# EAGLE design TQFP64 Programming Board (EAGLE 5.07)
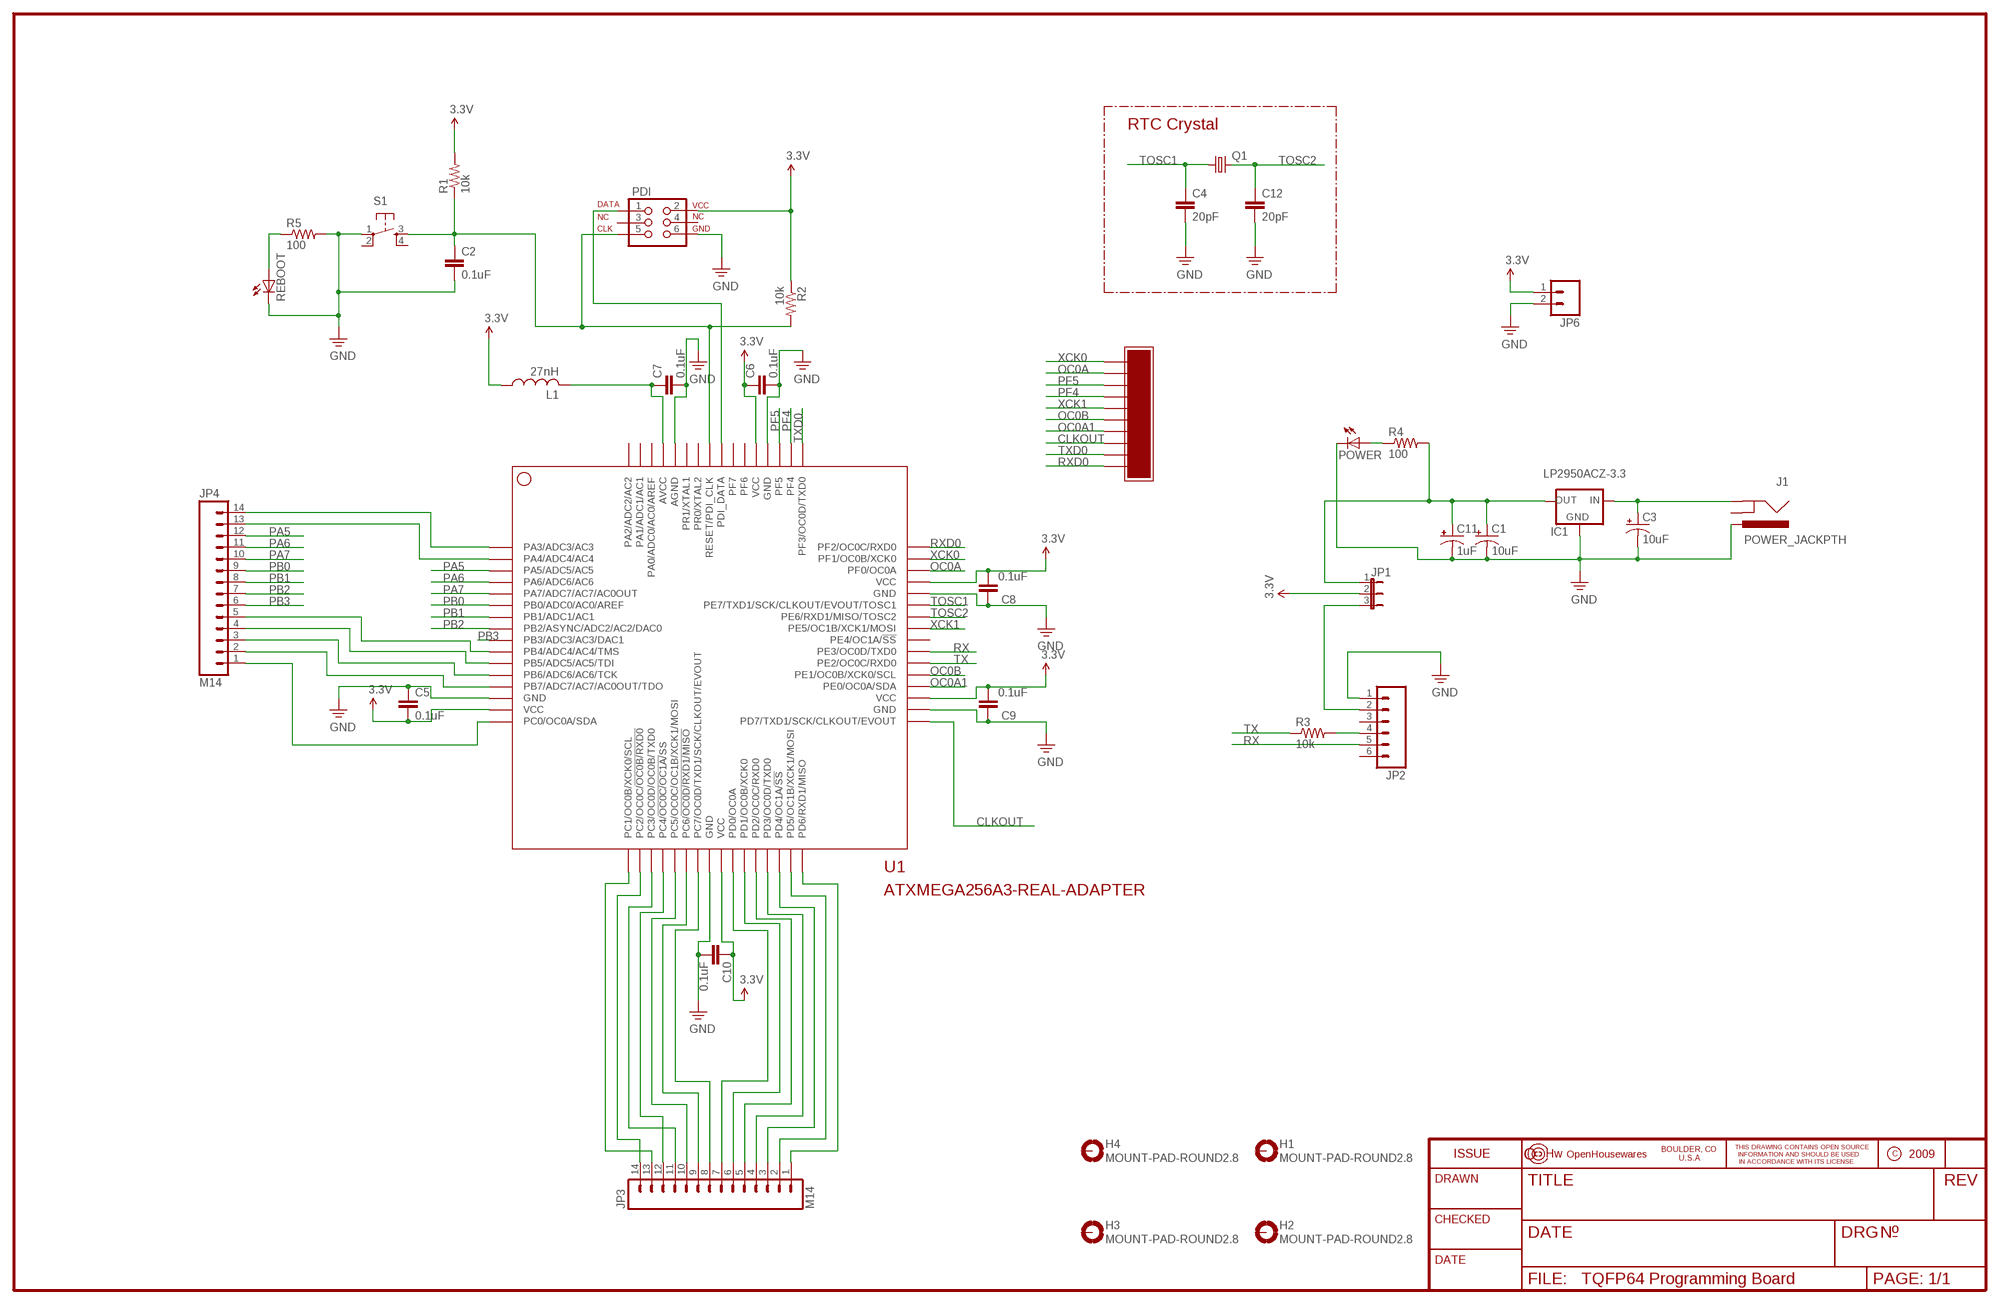
[diagram p0: schematic, sheet 1]

## Parts
C1  10uF  CPOL-USC/6032-28R  [C/6032-28R]
C2  0.1uF  C-EUC1206  [C1206]
C3  10uF  CPOL-USE2.5-5  [E2,5-5]
C4  20pF  C-EU025-024X044  [C025-024X044]
C5  0.1uF  C-EUC1206  [C1206]
C6  0.1uF  C-EUC1206  [C1206]
C7  0.1uF  C-EUC1206  [C1206]
C8  0.1uF  C-EUC1206  [C1206]
C9  0.1uF  C-EUC1206  [C1206]
C10  0.1uF  C-EUC1206  [C1206]
C11  1uF  CPOL-USE2.5-5  [E2,5-5]
C12  20pF  C-EU025-024X044  [C025-024X044]
H1  MOUNT-PAD-ROUND2.8  [2,8-PAD]
H2  MOUNT-PAD-ROUND2.8  [2,8-PAD]
H3  MOUNT-PAD-ROUND2.8  [2,8-PAD]
H4  MOUNT-PAD-ROUND2.8  [2,8-PAD]
IC1  LP2950ACZ-3.3  [TO92]
J1  POWER_JACKPTH  [POWER_JACK_PTH]
JP1  JP2W  [JP2W]
JP2  M06SIP  [1X06]
JP3  M14  [1X14]
JP4  M14  [1X14]
JP5  1X10_F_HEADER  [1X10_F_HEADER]
JP6  M02POLAR  [MOLEX-1X2]
L1  27nH  L-US0207/10  [0207/10]
PDI  XMEGA_PDI_PRGNS  [2X3-NS]
POWER  LED3MM  [LED3MM]
Q1  CRYSTALTC26H  [TC26H]
R1  10k  R-US_M1206  [M1206]
R2  10k  R-US_M1206  [M1206]
R3  10k  R-US_R1206  [R1206]
R4  100  R-US_0204/2V  [0204V]
R5  100  R-US_0204/2V  [0204V]
REBOOT  LED3MM  [LED3MM]
S1  TAC_SWITCHPTH  [TACTILE-PTH]
U1  ATXMEGA256A3-REAL-ADAPTER  [TQFP64-ADAPTER]

## Nets
3.3V: C5.2 C6.1 C8.2 C9.2 C10.1 JP1.2 JP6.1 L1.1 PDI.2 R1.2 R2.1 U1.15(VCC) U1.25(VCC) U1.35(VCC) U1.45(VCC) U1.53(VCC)
CLKOUT: JP5.8 U1.33(PD7/TXD1/SCK/CLKOUT/EVOUT)
GND: C1.- C2.2 C3.- C4.2 C5.1 C6.2 C7.2 C8.1 C9.1 C10.2 C11.- C12.2 IC1.2(GND) J1.PWR JP2.1 JP6.2 PDI.6 POWER.K(C) R5.2 REBOOT.K(C) S1.1 U1.14(GND) U1.24(GND) U1.34(GND) U1.44(GND) U1.52(GND) U1.60(AGND)
N$1: C2.1 PDI.5 R1.1 R2.2 S1.3 U1.57(RESET/PDI_CLK)
N$2: PDI.1 U1.56(PDI_DATA)
N$3: JP2.4 R3.2
N$4: JP1.3 JP2.2
N$5: C3.+ IC1.3(IN) J1.GND
N$6: JP3.10 U1.21(PC5/OC0C/OC1B/XCK1/MOSI)
N$7: C1.+ C11.+ IC1.1(OUT) JP1.1 R4.2
N$8: JP3.8 U1.23(PC7/OC0D/TXD1/SCK/CLKOUT/EVOUT)
N$9: JP3.9 U1.22(PC6/!OC0D/RXD1/MISO)
N$10: JP3.12 U1.20(PC4/!OC0C/OC1A/!SS)
N$11: JP3.11 U1.19(PC3/OC0D/OC0B/TXD0)
N$12: C7.1 L1.2 U1.61(AVCC)
N$13: JP3.14 U1.18(PC2/OC0C/!OC0B/RXD0)
N$14: JP3.13 U1.17(PC1/OC0B/XCK0/SCL)
N$15: JP3.7 U1.26(PD0/OC0A)
N$16: JP3.6 U1.27(PD1/OC0B/XCK0)
N$17: JP3.5 U1.28(PD2/OC0C/RXD0)
N$18: JP3.4 U1.29(PD3/OC0D/TXD0)
N$19: JP3.3 U1.30(PD4/OC1A/!SS)
N$20: JP3.2 U1.31(PD5/OC1B/XCK1/MOSI)
N$21: JP3.1 U1.32(PD6/RXD1/MISO)
N$22: JP4.14 U1.1(PA3/ADC3/AC3)
N$23: JP4.1 U1.16(PC0/OC0A/SDA)
N$24: JP4.2 U1.13(PB7/ADC7/AC7/AC0OUT/TDO)
N$25: JP4.13 U1.2(PA4/ADC4/AC4)
N$26: JP4.3 U1.12(PB6/ADC6/AC6/TCK)
N$27: JP4.4 U1.11(PB5/ADC5/AC5/TDI)
N$28: JP4.5 U1.10(PB4/ADC4/AC4/TMS)
N$31: POWER.A R4.1
N$32: R5.1 REBOOT.A
OC0A: JP5.2 U1.46(PF0/OC0A)
OC0A1: JP5.7 U1.36(PE0/OC0A/SDA)
OC0B: JP5.6 U1.37(PE1/OC0B/XCK0/SCL)
PA5: JP4.12 U1.3(PA5/ADC5/AC5)
PA6: JP4.11 U1.4(PA6/ADC6/AC6)
PA7: JP4.10 U1.5(PA7/ADC7/AC7/AC0OUT)
PB0: JP4.9 U1.6(PB0/ADC0/AC0/AREF)
PB1: JP4.8 U1.7(PB1/ADC1/AC1)
PB2: JP4.7 U1.8(PB2/ASYNC/ADC2/AC2/DAC0)
PB3: JP4.6 U1.9(PB3/ADC3/AC3/DAC1)
PF4: JP5.4 U1.50(PF4)
PF5: JP5.3 U1.51(PF5)
RX: JP2.5 U1.39(PE3/OC0D/TXD0)
RXD0: JP5.10 U1.48(PF2/OC0C/RXD0)
TOSC1: C4.1 Q1.1 U1.43(PE7/TXD1/SCK/CLKOUT/EVOUT/TOSC1)
TOSC2: C12.1 Q1.2 U1.42(PE6/RXD1/MISO/TOSC2)
TX: R3.1 U1.38(PE2/OC0C/RXD0)
TXD0: JP5.9 U1.49(PF3/OC0D/TXD0)
XCK0: JP5.1 U1.47(PF1/OC0B/XCK0)
XCK1: JP5.5 U1.41(PE5/OC1B/XCK1/MOSI)
Unconnected: H1.B2,8(MOUNT) H2.B2,8(MOUNT) H3.B2,8(MOUNT) H4.B2,8(MOUNT) J1.GNDBREAK JP2.3 JP2.6 PDI.3 PDI.4 S1.2 S1.4 U1.40(PE4/OC1A/!SS) U1.54(PF6) U1.55(PF7) U1.58(PR0/XTAL2) U1.59(PR1/XTAL1) U1.62(PA0/ADC0/AC0/AREF) U1.63(PA1/ADC1/AC1) U1.64(PA2/ADC2/AC2)

## Notes on the sheet
- RTC Crystal

## Library data of the parts
C1 C3 C11 = rcl:CPOL-US: POLARIZED CAPACITOR, American symbol
C2 C4-C10 C12 = rcl:C-EU: CAPACITOR, European symbol
H1-H4 = holes:MOUNT-PAD-ROUND: MOUNTING PAD, round
IC1 = v-reg:LP2950?*: Source: http://cache.national.com/ds/LP/LP2950.pdf
J1 = SparkFun:POWER_JACK: Power Jack This is the standard 5.5mm barrel jack for power. The PTH is the most common, proven, reliable, footprint. All others are experimental. The Slot footprint only works if the mill layer is transmitted to the PCB fab house so be warned. Spark Fun Electronics SKU : PRT-00119. Mating wall wart : TOL-00298 (and others)
JP1 = jumper:JP2W: JUMPER
JP2 = SparkFun:M06: Header 6 Standard 6-pin 0.1" header. Use with straight break away headers (SKU : PRT-00116), right angle break away headers (PRT-00553), swiss pins (PRT-00743), machine pins (PRT-00117), and female headers (PRT-00115). Molex polarized connector foot print use with SKU : PRT-08094 with associated crimp pins and housings. NOTES ON THE VARIANTS LOCK and LOCK_LONGPADS... This footprint was designed to help hold the alignment of a through-hole component (i.e. 6-pin header) while soldering it into place. You may notice that each hole has been shifted either up or down by 0.005 of an inch from it's more standard position (which is a perfectly straight line). This slight alteration caused the pins (the squares in the middle) to touch the edges of the holes. Because they are alternating, it causes a "brace" to hold the component in place. 0.005 has proven to be the perfect amount of "off-center" position when using our standard breakaway headers. Although looks a little odd when you look at the bare footprint, once you have a header in there, the alteration is very hard to notice. Also, if you push a header all the way into place, it is covered up entirely on the bottom side. This idea of altering the position of holes to aid alignment will be further integrated into the Sparkfun Library for other footprints. It can help hold any component with 3 or more connection pins.
JP3 JP4 = SparkFun:M14: Header 14 Standard 14-pin 0.1" header. Use with straight break away headers (SKU : PRT-00116), right angle break away headers (PRT-00553), swiss pins (PRT-00743), machine pins (PRT-00117), and female headers (PRT-00115).
JP5 = BattleDroids:1X10_F_HEADER
JP6 = SparkFun:M02: Header 2 Standard 2-pin 0.1" header. Use with straight break away headers (SKU : PRT-00116), right angle break away headers (PRT-00553), swiss pins (PRT-00743), machine pins (PRT-00117), and female headers (PRT-00115). Molex polarized connector foot print use with SKU : PRT-08233 with associated crimp pins and housings.
L1 = rcl:L-US: INDUCTOR, American symbol
PDI = BattleDroids:XMEGA_PDI_PRG: AVR ISP 6 Pin This is the reduced ISP connector for AVR programming. Common on Arduino. This footprint will take up less PCB space and can be used with a 10-pin to 6-pin adapter such as SKU: BOB-08508
POWER REBOOT = led:LED: LED OSRAM: - CHIPLED LG R971, LG N971, LY N971, LG Q971, LY Q971, LO R971, LY R971 LH N974, LH R974 LS Q976, LO Q976, LY Q976 LO Q996 - Hyper CHIPLED LW Q18S LB Q993, LB Q99A, LB R99A - SideLED LS A670, LO A670, LY A670, LG A670, LP A670 LB A673, LV A673, LT A673, LW A673 LH A674 LY A675 LS A676, LA A676, LO A676, LY A676, LW A676 LS A679, LY A679, LG A679 - Hyper Micro SIDELED® LS Y876, LA Y876, LO Y876, LY Y876 LT Y87S - SmartLED LW L88C, LW L88S LB L89C, LB L89S, LG L890 LS L89K, LO L89K, LY L89K LS L896, LA L896, LO L896, LY L896 - TOPLED LS T670, LO T670, LY T670, LG T670, LP T670 LSG T670, LSP T670, LSY T670, LOP T670, LYG T670 LG T671, LOG T671, LSG T671 LB T673, LV T673, LT T673, LW T673 LH T674 LS T676, LA T676, LO T676, LY T676, LB T676, LH T676, LSB T676, LW T676 LB T67C, LV T67C, LT T67C, LS T67K, LO T67K, LY T67K, LW E67C LS E67B, LA E67B, LO E67B, LY E67B, LB E67C, LV E67C, LT E67C LW T67C LS T679, LY T679, LG T679 LS T770, LO T770, LY T770, LG T770, LP T770 LB T773, LV T773, LT T773, LW T773 LH T774 LS E675, LA E675, LY E675, LS T675 LS T776, LA T776, LO T776, LY T776, LB T776 LHGB T686 LT T68C, LB T68C - Hyper Mini TOPLED® LB M676 - Mini TOPLED Santana® LG M470 LS M47K, LO M47K, LY M47K Source: http://www.osram.convergy.de LUXEON: - LUMILED® LXK2-PW12-R00, LXK2-PW12-S00, LXK2-PW14-U00, LXK2-PW14-V00 LXK2-PM12-R00, LXK2-PM12-S00, LXK2-PM14-U00 LXK2-PE12-Q00, LXK2-PE12-R00, LXK2-PE12-S00, LXK2-PE14-T00, LXK2-PE14-U00 LXK2-PB12-K00, LXK2-PB12-L00, LXK2-PB12-M00, LXK2-PB14-N00, LXK2-PB14-P00, LXK2-PB14-Q00 LXK2-PR12-L00, LXK2-PR12-M00, LXK2-PR14-Q00, LXK2-PR14-R00 LXK2-PD12-Q00, LXK2-PD12-R00, LXK2-PD12-S00 LXK2-PH12-R00, LXK2-PH12-S00 LXK2-PL12-P00, LXK2-PL12-Q00, LXK2-PL12-R00 Source: www.luxeon.com KINGBRIGHT: KA-3528ASYC Source: www.kingbright.com
Q1 = SparkFun:CRYSTAL: Crystals Various standard crystals. Proven footprints. Spark Fun Electronics SKU : COM-00534
R1-R5 = resistor:R-US_: RESISTOR, American symbol
S1 = SparkFun:TAC_SWITCH: Momentary Switch Button commonly used for reset or general input. Spark Fun Electronics SKU : COM-00097
U1 = BattleDroids:ATXMEGA256A3-REAL

## Board
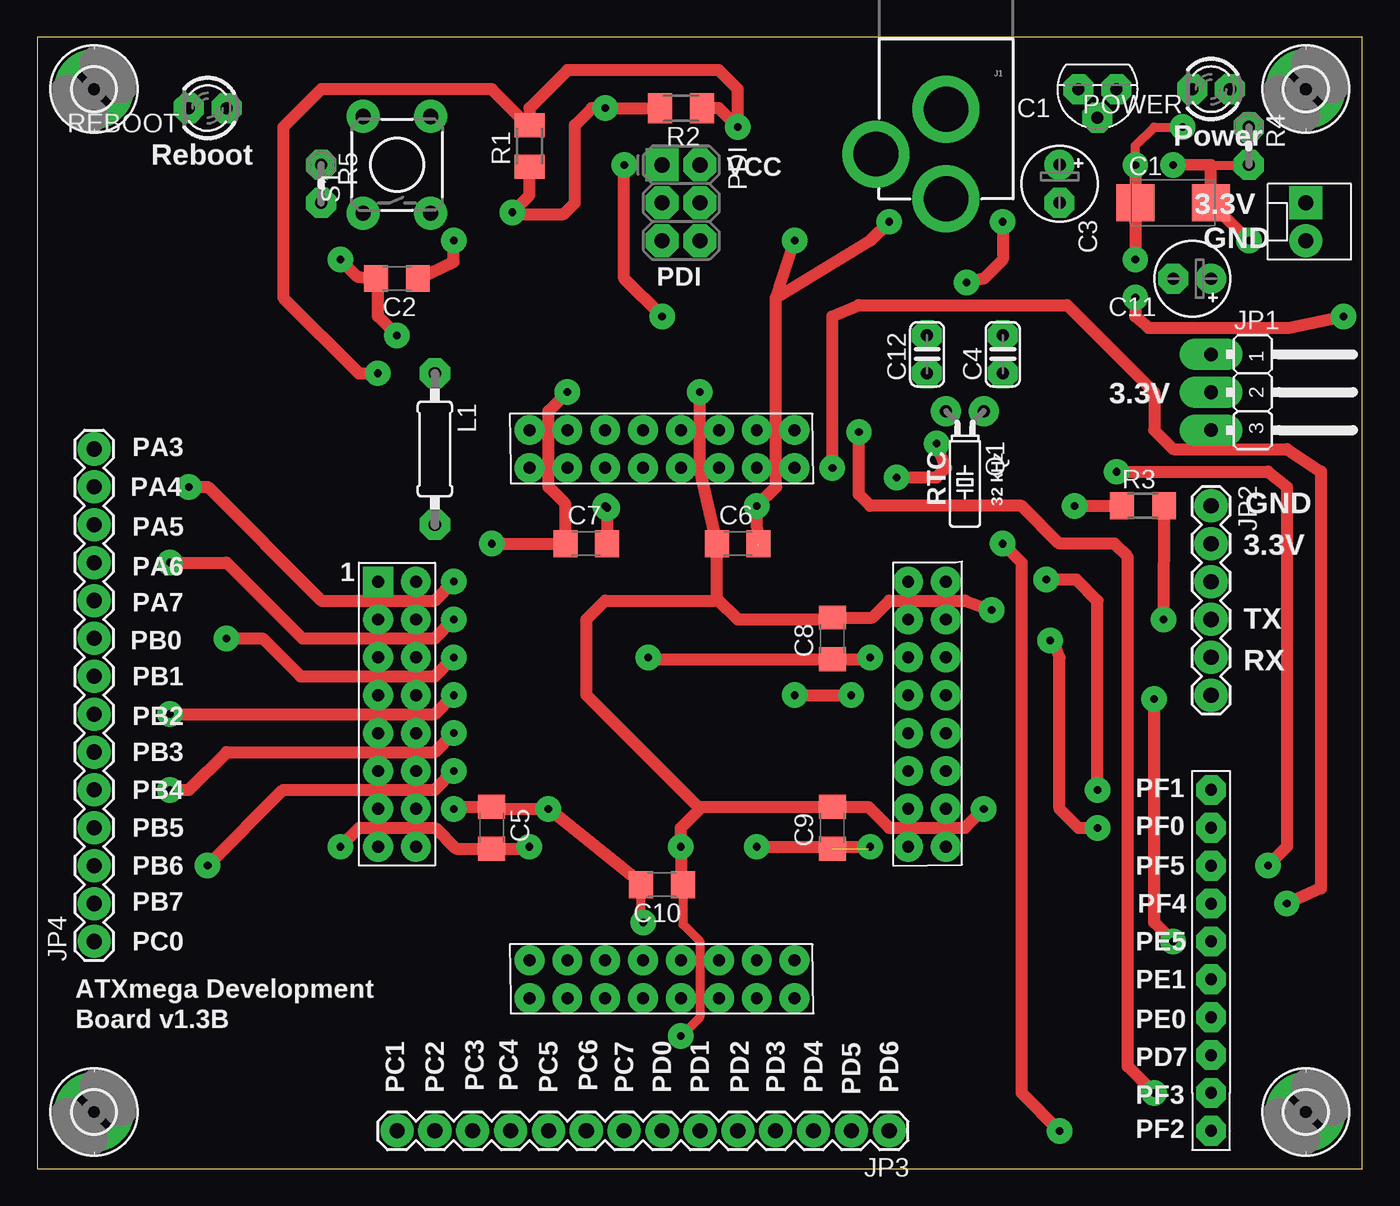
[diagram p1: board, top side]
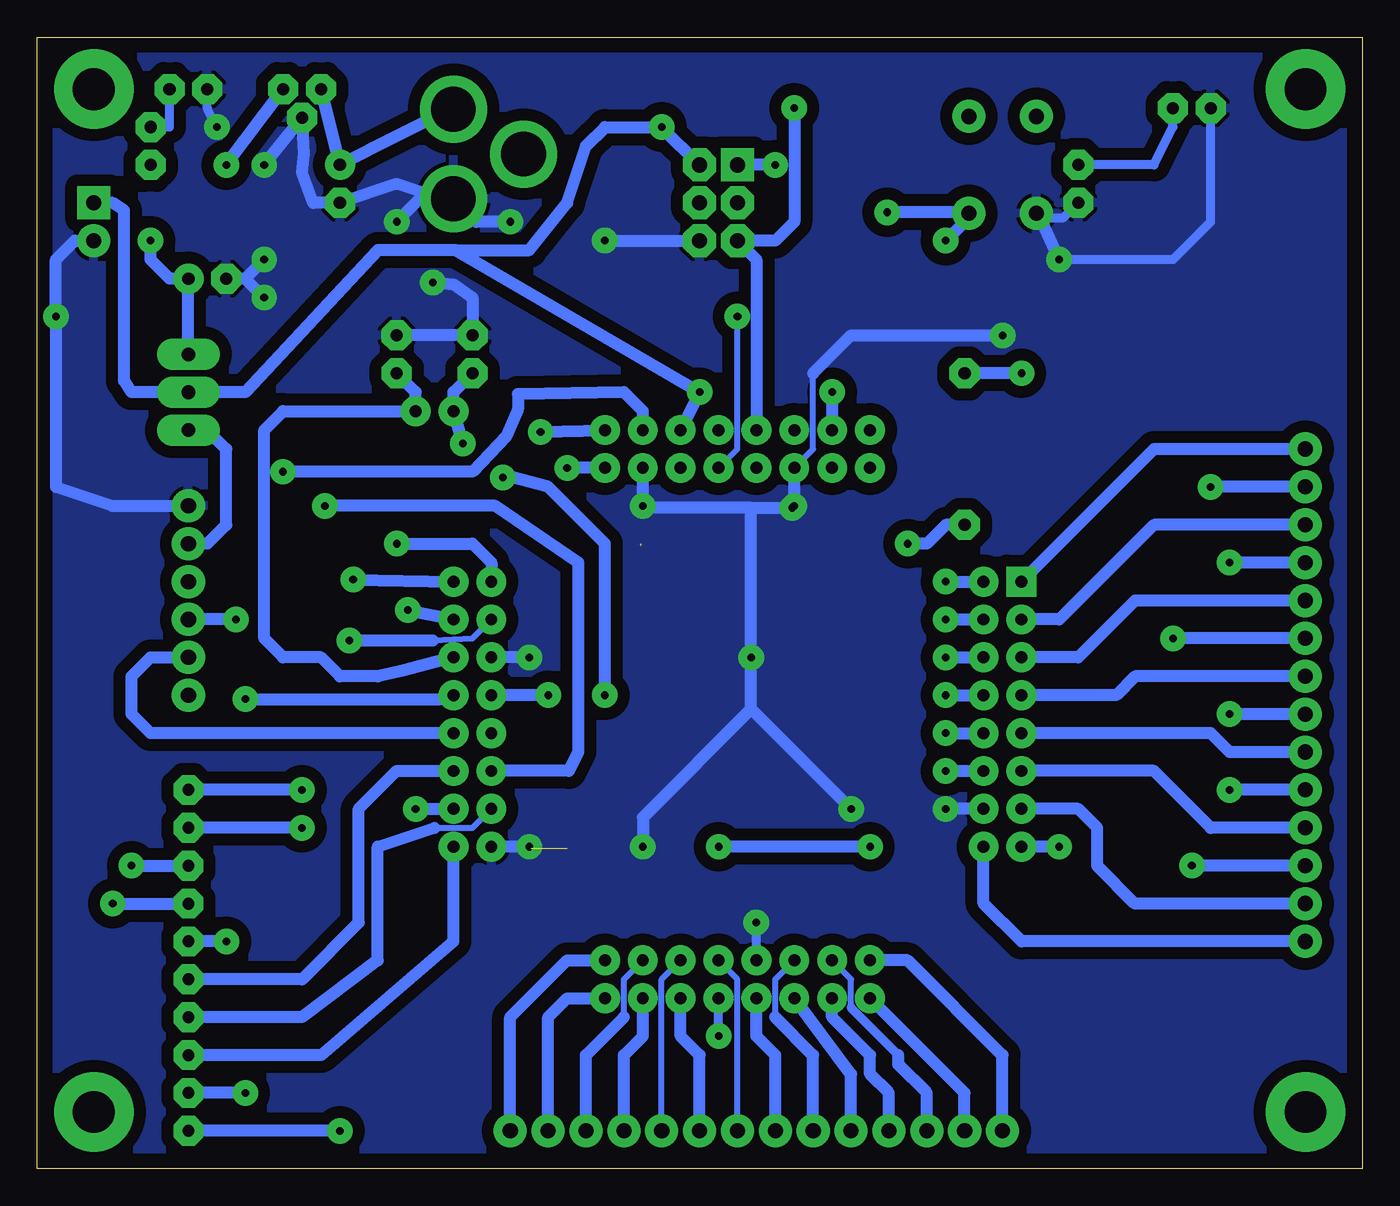
[diagram p2: board, bottom side, seen from below]

Size 88.88 x 75.87 mm. Coordinates in mm from the lower left corner, seen from the top.
Outline: 0,0 88.88,0 88.88,75.87 0,75.87 0,0
Copper layers (1*16): Top 0.035mm / dielectric 1.5mm / Bottom 0.035mm
Design rules "handmade": minimum track width 0.8mm, minimum drill 0.8mm, track to track 0.8mm, track to pad 0.8mm, pad to pad 0.45mm, via to via 0.8mm, smd to smd 8mil, copper to edge 40mil, drill to drill 8mil, minimum pad ring 0.6mm, minimum via ring 0.6mm, stop-mask expansion 4mil, vias tented up to drill 0mil, thermal gap 10mil

### Footprints (pad centres in the part's own frame; a part is rotated, then mirrored left to right if it is on the bottom)
C/6032-28R = smd 2.55 x 2.5: + 2.525,0; - -2.525,0
C1206 = smd 1.6 x 1.8: 1 -1.4,0; 2 1.4,0
E2,5-5 = drill 0.813 pad 1.6 round: + -1.27,0 | drill 0.813 pad 1.6 octagon: - 1.27,0
C025-024X044 = drill 0.813 octagon: 1 -1.27,0; 2 1.27,0
2,8-PAD = drill 2.8 pad 5.334 round: B2,8 0,0
TO92 = drill 0.813 octagon: 1 -1.27,0; 2 0,1.905; 3 1.27,0
POWER_JACK_PTH = drill 2.997 round: GND 0,7.7; GNDBREAK 4.7,10.7; PWR 0,13.7
JP2W = drill 0.914 long: 1 -2.54,-1.27; 2 0,-1.27; 3 2.54,-1.27
1X06 = drill 1.016 pad 1.88 round: 1 0,0; 2 2.54,0; 3 5.08,0; 4 7.62,0; 5 10.16,0; 6 12.7,0
1X14 = drill 1.016 pad 1.88 round: 1 0,0; 2 2.54,0; 3 5.08,0; 4 7.62,0; 5 10.16,0; 6 12.7,0; 7 15.24,0; 8 17.78,0; 9 20.32,0; 10 22.86,0; 11 25.4,0; 12 27.94,0; 13 30.48,0; 14 33.02,0
1X10_F_HEADER = drill 0.8 octagon: 1 0,12.7; 2 0,10.16; 3 0,7.62; 4 0,5.08; 5 0,2.54; 6 0,0; 7 0,-2.54; 8 0,-5.08; 9 0,-7.62; 10 0,-10.16
MOLEX-1X2 = drill 1.016 pad 1.88 square: 1 0,0 | drill 1.016 pad 1.88 round: 2 2.54,0
0207/10 = drill 0.813 octagon: 1 -5.08,0; 2 5.08,0
2X3-NS = drill 1.016 pad 1.88 square: 1 -2.54,-1.27 | drill 1.016 pad 1.88 octagon: 2 -2.54,1.27; 3 0,-1.27; 4 0,1.27; 5 2.54,-1.27; 6 2.54,1.27
LED3MM = drill 0.813 octagon: A -1.27,0; K 1.27,0
TC26H = drill 0.813 pad 1.676 round: 1 -1.27,0; 2 1.27,0
M1206 = smd 1.6 x 2: 1 -1.4,0; 2 1.4,0
R1206 = smd 1.6 x 1.803: 1 -1.422,0; 2 1.422,0
0204V = drill 0.813 octagon: 1 -1.27,0; 2 1.27,0
TACTILE-PTH = drill 1.016 round: 1 -3.251,2.261; 2 3.251,2.261; 3 -3.251,-2.261; 4 3.251,-2.261
TQFP64-ADAPTER = drill 0.8 square: 1 -17.78,10.16 | drill 0.8 round: 2 -15.24,10.16; 3 -17.78,7.62; 4 -15.24,7.62; 5 -17.78,5.08; 6 -15.24,5.08; 7 -17.78,2.54; 8 -15.24,2.54; 9 -17.78,0; 10 -15.24,0; 11 -17.78,-2.54; 12 -15.24,-2.54; 13 -17.78,-5.08; 14 -15.24,-5.08; 15 -17.78,-7.62; 16 -15.24,-7.62; 17 -7.62,-17.78; 18 -7.62,-15.24; 19 -5.08,-17.78; 20 -5.08,-15.24; 21 -2.54,-17.78; 22 -2.54,-15.24; 23 0,-17.78; 24 0,-15.24; 25 2.54,-17.78; 26 2.54,-15.24; 27 5.08,-17.78; 28 5.08,-15.24; 29 7.62,-17.78; 30 7.62,-15.24; 31 10.16,-17.78; 32 10.16,-15.24; 33 20.32,-7.62; 34 17.78,-7.62; 35 20.32,-5.08; 36 17.78,-5.08; 37 20.32,-2.54; 38 17.78,-2.54; 39 20.32,0; 40 17.78,0; 41 20.32,2.54; 42 17.78,2.54; 43 20.32,5.08; 44 17.78,5.08; 45 20.32,7.62; 46 17.78,7.62; 47 20.32,10.16; 48 17.78,10.16; 49 10.16,20.32; 50 10.16,17.78; 51 7.62,20.32; 52 7.62,17.78; 53 5.08,20.32; 54 5.08,17.78; 55 2.54,20.32; 56 2.54,17.78; 57 0,20.32; 58 0,17.78; 59 -2.54,20.32; 60 -2.54,17.78; 61 -5.08,20.32; 62 -5.08,17.78; 63 -7.62,20.32; 64 -7.62,17.78

### Placement (x,y rotation side)
C1  76.2,64.77 0 top
C2  24.13,59.69 180 top
C3  68.58,66.04 270 top
C4  64.77,54.61 90 top
C5  30.48,22.86 270 top
C6  46.99,41.91 0 top
C7  36.83,41.91 0 top
C8  53.34,35.56 90 top
C9  53.34,22.86 90 top
C10  41.91,19.05 180 top
C11  77.47,59.69 180 top
C12  59.69,54.61 90 top
H1  3.81,72.39 0 top
H2  3.81,3.81 0 top
H3  85.09,72.39 0 top
H4  85.09,3.81 0 top
IC1  71.12,72.39 180 top
J1  60.96,78.74 180 top
JP1  80.01,52.07 270 top
JP2  78.74,44.45 270 top
JP3  57.15,2.54 180 top
JP4  3.81,15.24 90 top
JP5  78.74,12.7 0 top
JP6  85.09,64.77 270 top
L1  26.67,48.26 270 top
PDI  43.18,64.77 270 top
POWER  78.74,72.39 180 top
Q1  62.23,50.8 180 top
R1  33.02,68.58 90 top
R2  43.18,71.12 180 top
R3  74.17,44.45 0 top
R4  81.28,68.58 270 top
R5  19.05,66.04 270 top
REBOOT  11.43,71.12 180 top
S1  24.13,67.31 90 top
U1  40.64,29.21 0 top

### Tracks (layer width: path | path; a pad name or v marks a point on that pad's centre or on a via)
3.3V  (via drill 0.51)
  Top 0.61: C10.1 43.31,16.38 44.45,15.24 44.45,10.16 v43.18,8.89
  Top 0.813: v44.45,52.07 44.45,46.86 C6.1 45.59,38.23 | R2.1 45.72,71.12 v46.99,69.85 46.99,72.39 45.72,73.66 35.56,73.66 33.02,71.12 R1.2 32.89,69.98 30.48,72.39 19.05,72.39 16.51,69.85 16.51,58.42 21.59,53.34 v22.86,53.34 | v20.32,21.59 21.59,22.86 26.67,22.86 28.07,21.46 C5.2 32.89,21.46 v33.02,21.59 | v63.5,24.13 62.23,22.86 57.15,22.86 55.75,24.26 C9.2 44.58,24.26 44.45,24.13 | v64.01,37.47 62.23,38.1 57.15,38.1 56.01,36.96 C8.2 53.21,36.83 46.99,36.83 45.59,38.23 | C10.1 43.18,19.18 v43.18,21.59 43.18,22.86 44.45,24.13 | 44.45,24.13 36.83,31.75 36.83,36.83 38.1,38.1 45.46,38.1 45.59,38.23
  Bottom 0.61: v43.18,8.89 U1.25
  Bottom 0.813: 60.83,61.59 55.88,61.59 53.34,64.77 52.07,68.58 50.8,69.85 v46.99,69.85 PDI.2 | 60.83,61.59 66.04,61.59 74.93,52.07 JP1.2 82.55,52.07 83.06,52.83 83.06,64.26 83.82,64.77 JP6.1 | U1.53 v44.45,52.07 60.83,61.59 | v20.32,21.59 U1.15 | v63.5,24.13 U1.35 | v64.01,37.47 U1.45 | v33.02,21.59 v43.18,21.59 | v22.86,53.34 L1.1
CLKOUT
  Bottom 0.813: U1.33 60.96,15.24 69.85,7.62 JP5.8
GND  (via drill 0.51)  (2 unrouted)
  Top 0.61: C10.2 40.51,16.64 v40.64,16.51 | v73.66,67.31 73.66,68.58 74.93,69.85 v76.83,69.85
  Top 0.813: C2.2 21.46,59.82 v20.32,60.96 | C5.1 28.07,24.26 v27.94,24.13 | v55.88,34.29 55.75,34.16 C8.1 41.12,34.16 v40.99,34.29 | 49.55,58.41 v50.8,62.23 | 48.39,41.78 48.26,43.18 v48.26,44.45 49.56,45.72 49.55,58.41 | C7.2 v38.23,44.32 v38.1,44.45 | 55.75,21.46 v55.88,21.59 v48.26,21.59 | 30.61,24.13 v34.29,24.13 40.64,19.05 | v24.13,55.88 22.86,57.15 22.86,59.56 | v73.66,67.31 73.67,67.3 C1.- 73.66,63.48 v73.66,60.96 | v73.66,58.42 73.66,57.15 74.55,56.39 83.95,56.39 v87.63,57.15 | 49.55,58.41 55.9,62.24 v57.15,63.5 | v62.36,59.44 63.5,59.69 64.77,60.96 v64.77,63.5
  Bottom 0.406: U1.60 36.83,48.26 36.83,53.34
  Bottom 0.61: U1.24 v40.64,16.51 | v76.83,69.85 77.47,71.12 POWER.K | 21.59,63.78 20.04,63.78 R5.2 | REBOOT.K 10.16,63.5 12.7,60.96 v20.32,60.96
  Bottom 0.813: v20.32,60.96 21.59,63.78 S1.1 | U1.14 v27.94,24.13 | v55.88,34.29 U1.44 | v38.1,44.45 U1.60 | 40.99,44.32 v38.23,44.32 | 40.99,44.32 48.13,44.32 v48.26,44.45 U1.52 | 40.99,44.32 v40.99,34.29 40.99,30.83 | v34.29,24.13 40.99,30.83 | v48.26,21.59 48.26,23.56 40.99,30.83 | 36.83,53.34 34.29,55.88 v24.13,55.88 | v55.88,21.59 U1.34 | 62.87,65.41 62.5,65.04 J1.PWR 59.42,63.5 v57.15,63.5 | 62.87,65.41 64.77,66.04 C3.- 70.36,64.77 71.12,66.8 70.99,68.07 IC1.2 v73.66,67.31 | v73.66,60.96 74.93,59.69 | JP2.1 83.82,44.45 87.63,45.72 v87.63,57.15 87.63,60.96 86.36,62.23 JP6.2 | 74.93,59.69 C11.- | 74.93,59.69 v73.66,58.42 | v50.8,62.23 PDI.6 | C4.2 C12.2 59.69,58.42 60.96,59.31 v62.36,59.44 | 62.87,65.41 v64.77,63.5
  pour Bottom: 0,76.2 0,0 88.9,0 88.9,76.2
N$1  (via drill 0.51)
  Top 0.813: R2.2 v38.1,71.12 37.21,71.12 36.07,69.98 36.07,64.77 35.31,64.01 32,64.01 v31.88,64.14 33.02,65.28 R1.1 | v27.94,62.23 27.94,60.83 C2.1
  Bottom 0.813: U1.57 40.64,60.96 PDI.5 39.37,62.23 38.1,63.5 v38.1,71.12 | v31.88,64.14 26.47,64.14 S1.3 26.39,63.78 v27.94,62.23
N$2  (via drill 0.51)
  Top 0.813: v41.91,57.15 39.37,59.69 v39.37,67.31
  Bottom 0.406: U1.56 41.91,48.26 v41.91,57.15
  Bottom 0.813: v39.37,67.31 PDI.1
N$3  (via drill 0.51)
  Top 0.813: v75.56,36.83 R3.2
  Bottom 0.813: v75.56,36.83 JP2.4
N$4
  Bottom 0.813: JP2.2 77.47,41.91 76.2,43.18 76.2,48.26 77.47,49.53 JP1.3
N$5
  Bottom 0.61: J1.GND 61.04,71.12
  Bottom 0.813: 61.04,71.12 C3.+ IC1.3
N$6
  Bottom 0.813: U1.21 34.29,6.35 JP3.10
N$7  (via drill 0.51)
  Top 0.61: 78.72,67.3 81.27,67.3 R4.2
  Top 0.813: v76.2,67.31 78.72,67.3 C1.+ 80,63.52 v81.28,62.23
  Bottom 0.813: v76.2,67.31 IC1.1 | v81.28,62.23 81.28,60.96 80.01,59.69 C11.+ JP1.1
N$8
  Bottom 0.813: U1.23 40.64,8.89 39.37,7.62 JP3.8
N$9
  Bottom 0.406: U1.22 39.37,12.7 39.37,10.16
  Bottom 0.813: 39.37,10.16 36.83,7.62 JP3.9
N$10
  Bottom 0.406: U1.20 34.29,12.7 34.29,10.79
  Bottom 0.61: 31.11,7.62 34.29,10.79
  Bottom 0.813: 31.11,7.62 31.11,6.99 29.21,5.08 JP3.12
N$11
  Bottom 0.813: U1.19 35.56,10.16 33.02,7.62 33.02,6.35 31.75,5.08 JP3.11
N$12  (via drill 0.51)
  Top 0.813: v35.56,52.07 34.29,50.8 34.29,45.72 35.43,44.58 C7.1 v30.48,41.91
  Bottom 0.813: v35.56,52.07 U1.61 | L1.2 27.94,43.18 29.21,41.91 v30.48,41.91
N$13
  Bottom 0.813: U1.18 30.48,13.97 24.13,7.62 JP3.14
N$14
  Bottom 0.813: U1.17 26.67,5.08 JP3.13
N$15
  Bottom 0.406: U1.26 41.91,12.7 JP3.7
N$16
  Bottom 0.813: U1.27 45.72,8.89 44.45,7.62 JP3.6
N$17
  Bottom 0.406: U1.28 46.99,12.7 JP3.5
N$18
  Bottom 0.813: U1.29 48.26,8.89 49.53,7.62 JP3.4
N$19
  Bottom 0.406: U1.30 49.53,12.7 49.53,10.16
  Bottom 0.813: 49.53,10.16 52.07,7.62 JP3.3
N$20
  Bottom 0.813: U1.31 53.34,11.43 54.61,10.16 JP3.2
N$21
  Bottom 0.813: U1.32 53.34,13.97 57.15,10.16 JP3.1
N$22
  Bottom 0.813: U1.1 13.97,48.26 JP4.14
N$23
  Bottom 0.813: U1.16 25.4,17.78 22.86,15.24 JP4.1
N$24
  Bottom 0.813: JP4.2 15.24,17.78 17.78,20.32 17.78,22.86 19.05,24.13 U1.13
N$25  (via drill 0.51)
  Top 0.813: v10.16,45.72 11.43,45.72 19.05,38.1 26.67,38.1 v27.94,39.37
  Bottom 0.813: JP4.13 v10.16,45.72 | v27.94,39.37 U1.2
N$26  (via drill 0.51)
  Top 0.813: v27.94,26.67 26.67,25.4 16.51,25.4 v11.43,20.32
  Bottom 0.813: v27.94,26.67 U1.12 | JP4.3 v11.43,20.32
N$27
  Bottom 0.813: U1.11 13.97,26.67 10.16,22.86 JP4.4
N$28  (via drill 0.51)
  Top 0.813: v8.89,25.4 10.16,25.4 12.7,27.94 26.67,27.94 v27.94,29.21
  Bottom 0.813: JP4.5 v8.89,25.4 | v27.94,29.21 U1.10
N$31
  Bottom 0.61: R4.1 80.01,69.85 POWER.A
N$32
  Bottom 0.61: R5.1 13.97,67.31 12.7,69.85 REBOOT.A
OC0A  (via drill 0.51)
  Top 0.813: v67.94,35.43 68.2,35.43 68.58,34.29 68.58,24.13 69.85,22.86 v71.12,22.86
  Bottom 0.406: U1.46 59.69,35.56 62.36,35.43
  Bottom 0.813: v67.94,35.43 62.36,35.43 | v71.12,22.86 JP5.2
OC0A1
  Bottom 0.406: U1.36 59.69,22.86 62.23,22.86
  Bottom 0.813: 62.23,22.86 66.04,21.59 66.04,13.97 71.12,10.16 JP5.7
OC0B
  Bottom 0.813: U1.37 64.77,26.67 67.31,24.13 67.31,16.51 71.12,12.7 JP5.6
PA5
  Bottom 0.813: U1.3 20.32,36.83 13.97,43.18 JP4.12
PA6  (via drill 0.51)
  Top 0.813: v8.89,40.64 12.7,40.64 17.78,35.56 26.67,35.56 v27.94,36.83
  Bottom 0.813: JP4.11 v8.89,40.64 | v27.94,36.83 U1.4
PA7
  Bottom 0.813: JP4.10 15.24,38.1 19.05,34.29 U1.5
PB0  (via drill 0.51)
  Top 0.813: v12.7,35.56 15.11,35.56 17.65,33.02 26.67,33.02 v27.94,34.29
  Bottom 0.813: JP4.9 v12.7,35.56 | v27.94,34.29 U1.6
PB1
  Bottom 0.813: JP4.8 15.24,33.02 16.51,31.75 U1.7
PB2  (via drill 0.51)
  Top 0.813: v8.89,30.48 26.67,30.48 v27.94,31.75
  Bottom 0.813: JP4.7 v8.89,30.48 | v27.94,31.75 U1.8
PB3
  Bottom 0.813: U1.9 10.16,29.21 8.89,27.94 JP4.6
PF4  (via drill 0.51)
  Top 0.813: v53.34,46.99 53.34,57.15 55.12,57.91 69.09,57.91 74.93,52.07 74.93,49.53 76.2,48.26 83.82,48.26 86.11,46.74 86.11,18.8 v83.82,17.78
  Bottom 0.813: U1.50 v53.34,46.99 | v83.82,17.78 JP5.4
PF5  (via drill 0.51)
  Top 0.813: v72.39,46.74 82.55,46.74 83.82,45.72 83.82,21.59 v82.55,20.32
  Bottom 0.813: U1.51 48.26,50.8 49.53,52.07 56.64,51.94 56.64,50.93 57.4,49.15 59.69,46.74 v72.39,46.74 | v82.55,20.32 JP5.3
RX
  Bottom 0.813: U1.39 81.28,29.21 82.55,30.48 82.55,33.02 81.28,34.29 JP2.5
RXD0  (via drill 0.51)
  Top 0.813: v64.77,41.91 66.04,40.64 66.04,5.08 v68.58,2.54
  Bottom 0.813: U1.48 58.42,40.64 59.69,41.91 v64.77,41.91 | v68.58,2.54 JP5.10
TOSC1
  Bottom 0.813: U1.43 64.39,33.4 66.04,33.02 68.58,33.02 69.85,34.29 72.39,34.29 73.66,35.56 73.66,49.53 72.39,50.8 Q1.1 63.5,52.07 C4.1
TOSC2  (via drill 0.51)
  Top 0.813: v50.8,31.75 v54.61,31.75 | v57.66,46.35 60.33,46.35 60.96,46.99 v60.33,48.64
  Bottom 0.813: v54.61,31.75 U1.42 | v50.8,31.75 50.8,41.91 54.61,45.72 57.02,46.35 v57.66,46.35 | v60.33,48.64 Q1.2 60.96,52.07 C12.1
TX  (via drill 0.51)
  Top 0.813: v69.6,44.45 R3.1
  Bottom 0.813: U1.38 53.21,26.67 52.58,27.94 52.58,40.64 58.17,44.45 v69.6,44.45
TXD0  (via drill 0.51)
  Top 0.813: v55.12,49.4 55.12,45.21 55.88,44.45 66.04,44.45 68.58,41.91 72.26,41.91 73.15,41.02 73.15,6.86 v74.93,5.08
  Bottom 0.813: v55.12,49.4 U1.49 | v74.93,5.08 JP5.9
XCK0  (via drill 0.51)
  Top 0.813: v67.69,39.5 69.72,39.5 71.12,38.1 v71.12,25.4
  Bottom 0.813: v67.69,39.5 U1.47 | v71.12,25.4 JP5.1
XCK1  (via drill 0.51)
  Top 0.813: v74.93,31.5 74.93,16.51 v76.2,15.24
  Bottom 0.813: U1.41 61.85,31.5 v74.93,31.5 | v76.2,15.24 JP5.5

### Text on the board
tPlace: Power | Reboot | VCC | 3.3V | GND | PDI | 3.3V | PA3 | PA4 | RTC | 32 kHz | GND | PA5 | 3.3V | PA6 | 1 | PA7 | TX | PB0 | RX | PB1 | PB2 | PB3 | PB4 | PF1 | PB5 | PF0 | PB6 | PF5 | PB7 | PF4 | PC0 | PE5 | PE1 | ATXmega Development | Board v1.3B | PE0 | PD7 | PC1 | PC2 | PC3 | PC4 | PC5 | PC6 | PC7 | PD0 | PD1 | PD2 | PD3 | PD4 | PD5 | PD6 | PF3 | PF2